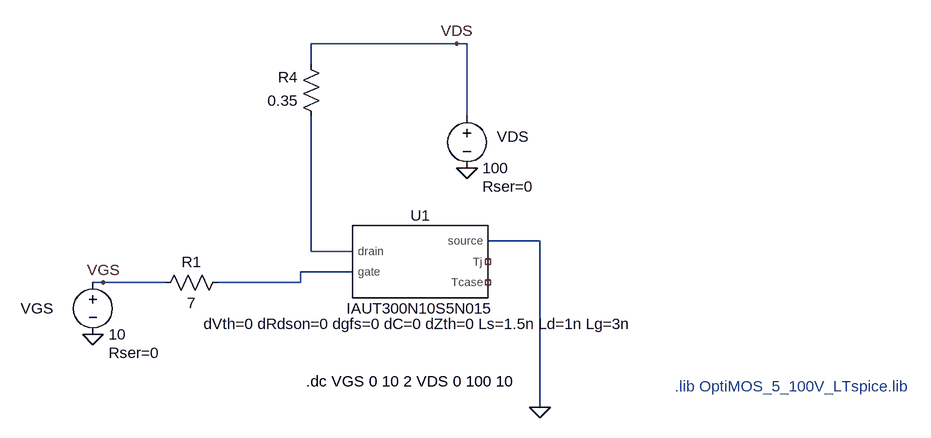
[diagram p0: schematic Test.asc]
Test.asc, the LTspice schematic file:
Version 4.1
SHEET 1 1740 884
WIRE 1024 304 800 304
WIRE 1040 304 1024 304
WIRE 800 336 800 304
WIRE 1040 416 1040 304
WIRE 1152 608 1072 608
WIRE 800 624 800 416
WIRE 864 624 800 624
WIRE 864 656 784 656
WIRE 480 672 464 672
WIRE 576 672 480 672
WIRE 784 672 784 656
WIRE 784 672 656 672
WIRE 1152 864 1152 608
FLAG 464 752 0
FLAG 1040 496 0
FLAG 1152 864 0
FLAG 480 672 VGS
FLAG 1024 304 VDS
SYMBOL res 672 656 R90
WINDOW 0 0 56 VBottom 2
WINDOW 3 32 56 VTop 2
SYMATTR InstName R1
SYMATTR Value 7
SYMBOL res 816 432 R180
WINDOW 0 36 76 Left 2
WINDOW 3 36 40 Left 2
SYMATTR InstName R4
SYMATTR Value 0.35
SYMBOL voltage 464 656 R0
WINDOW 123 0 0 Left 0
WINDOW 39 24 124 Left 2
WINDOW 0 -111 56 Left 2
SYMATTR SpiceLine Rser=0
SYMATTR InstName VGS
SYMATTR Value 10
SYMBOL voltage 1040 400 R0
WINDOW 123 0 0 Left 0
WINDOW 39 24 124 Left 2
WINDOW 0 46 47 Left 2
SYMATTR SpiceLine Rser=0
SYMATTR InstName VDS
SYMATTR Value 100
SYMBOL IAUT300N10S5N015 960 640 R0
SYMATTR InstName U1
TEXT 792 824 Left 2 !.dc VGS 0 10 2 VDS 0 100 10
TEXT 1360 832 Left 2 ;.lib OptiMOS_5_100V_LTspice.lib

The netlist it stands for:
* Test.asc
R1 N002 VGS 7
R4 N001 VDS 0.35
VGS VGS 0 10 Rser=0
VDS VDS 0 100 Rser=0
X§U1 N001 N002 0 NC_01 NC_02 IAUT300N10S5N015 dVth=0 dRdson=0 dgfs=0 dC=0 dZth=0 Ls=1.5n Ld=1n Lg=3n  ; pins drain gate source Tj Tcase
.dc VGS 0 10 2 VDS 0 100 10
* .lib OptiMOS_5_100V_LTspice.lib
.lib D:\WORKSPACE\BSIM-Python-Implementation\model\OptiMOS_5_100V_LTspice.lib
.backanno
.end